# Altium schematic sheet AD_DA.SchDoc
size A4; SheetNumber: 1; SheetTotal: 6
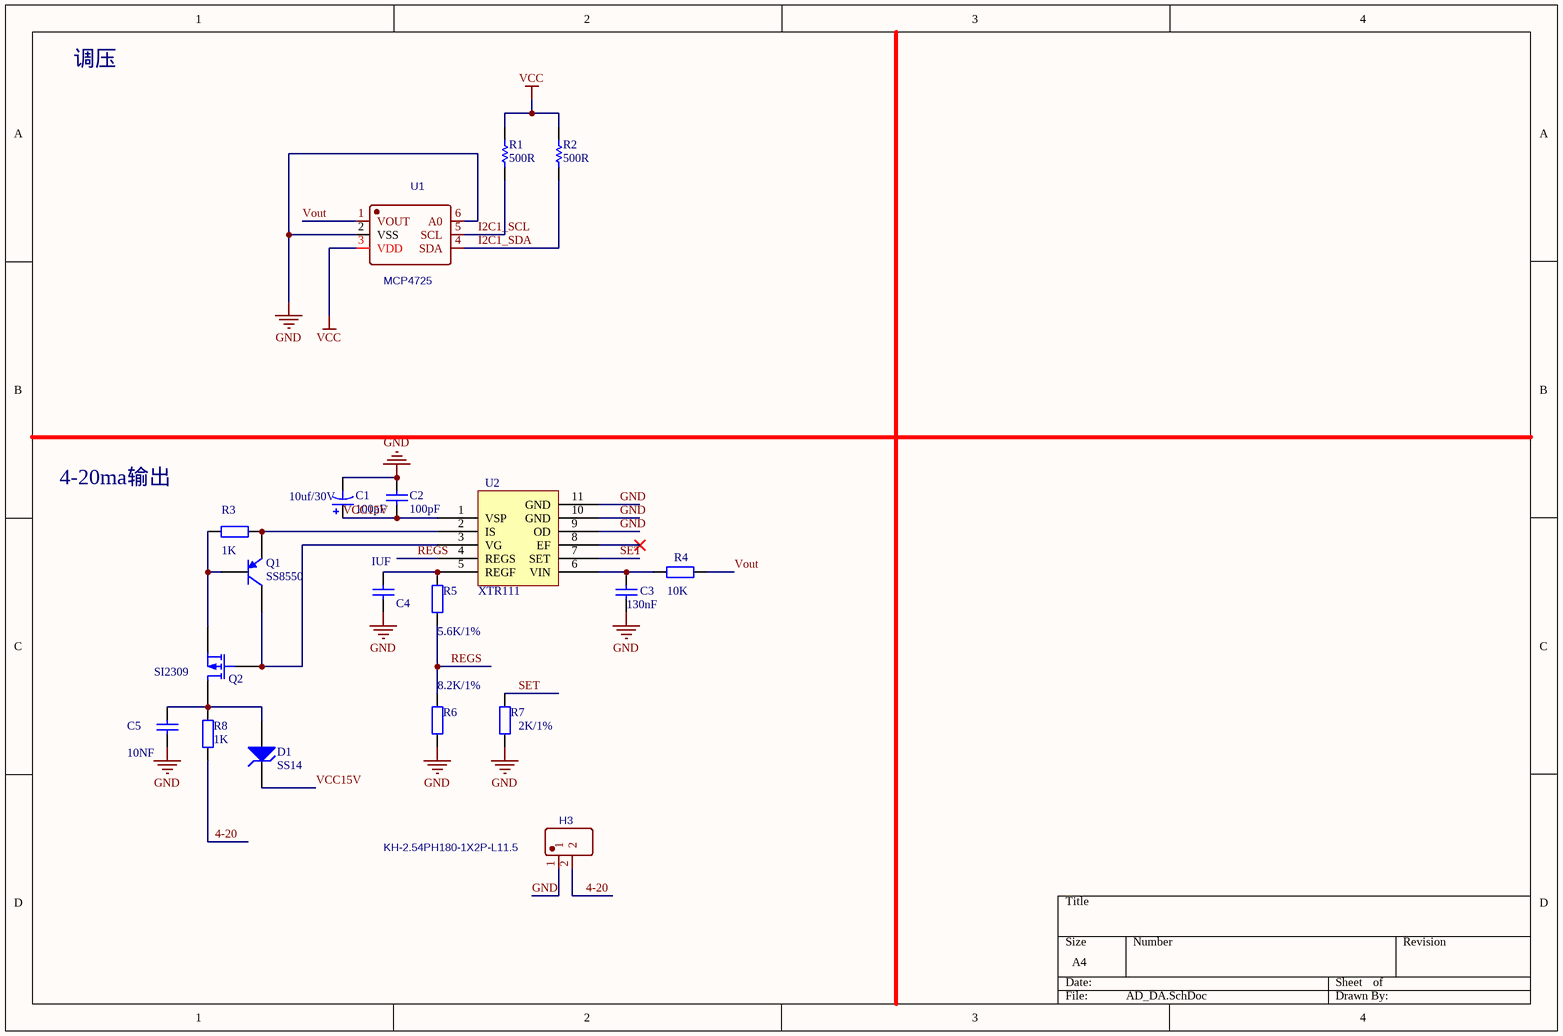
[diagram p0: AD_DA.SchDoc]

## Parts
C1  10uf/30V  value 100pF  [RB7.6-15]
C2  value 100pF  [RAD-0.3]  (hidden comment: 104)
C3  130nF  [0603]
C4  IUF  [RAD-0.3]
C5  10NF  [RAD-0.3]
D1  SS14  [DIODE-0.7]
H3  KH-2.54PH180-1X2P-L11.5  [1*2P]
Q1  SS8550  [SOT-23B_N]
Q2  SI2309  [E3]
R1  500R  [0805R]
R2  500R  [0805R]
R3  value 1K  [0603_R]  (hidden comment: 15R)
R4  10K  [0603_R]
R5  5.6K/1%  [0603_R]
R6  8.2K/1%  [0603_R]
R7  2K/1%  [0603_R]
R8  value 1K  [0603_R]  (hidden comment: 15R)
U1  MCP4725  [MCP4725]
U2  XTR111  [XTR111]

## Nets
GND: C1.2 C2.1 C3.2 C4.1 C5.2 H3.1 R6.2 R7.1 U1.2(VSS) U1.6(A0) U2.9(OD) U2.10(GND) U2.11(GND)
VCC: R1.2 R2.2 U1.3(VDD)
4-20: H3.2 R8.2
I2C1_SCL: R1.1 U1.5(SCL)
I2C1_SDA: R2.1 U1.4(SDA)
REGS: R5.2 R6.1 U2.4(REGS)
SET: R7.2 U2.7(SET)
VCC15V: C1.1 C2.2 D1.2(K) U2.1(VSP)
Vout: R4.2 U1.1(VOUT)
NetC3_1: C3.1 R4.1 U2.6(VIN)
NetC4_2: C4.2 R5.1 U2.5(REGF)
NetC5_1: C5.1 D1.1(A) Q2.1(D) R8.1
NetQ1_1: Q1.1(C) Q2.2(G) U2.3(VG)
NetQ1_2: Q1.2(B) Q2.3(S) R3.2
NetQ1_3: Q1.3(E) R3.1 U2.2(IS)

Not connected (* = marked no-connect by the designer): U2 8(EF)*

## Notes on the sheet
- 调压
- 4-20ma输出

## Library data of the parts
C1 = Cap Pol1: Polarized Capacitor (Radial); Published: 8-Jun-2000; LatestRevisionDate: 17-Jul-2002; LatestRevisionNote: Re-released for DXP Platform.; PackageReference: RB7.6-15; Publisher: Altium Limited; PackageDescription: Polarized Capacitor (Radial); 2 Leads
C2 = Cap: Capacitor; Published: 8-Jun-2000; LatestRevisionDate: 17-Jul-2002; LatestRevisionNote: Re-released for DXP Platform.; PackageReference: RAD-0.3; Publisher: Altium Limited; PackageDescription: Radial Cap, Thru-Hole; 2 Leads; 0.3 in Pin Spacing
C3 = Cap Smd: Capacitor
C4 C5 = Cap: Capacitor; Value: 100pF; Published: 8-Jun-2000; LatestRevisionDate: 17-Jul-2002; LatestRevisionNote: Re-released for DXP Platform.; PackageReference: RAD-0.3; Publisher: Altium Limited; PackageDescription: Radial Cap, Thru-Hole; 2 Leads; 0.3 in Pin Spacing
D1 = D Zener: Zener Diode; Published: 8-Jun-2000; Publisher: Altium Limited; LatestRevisionDate: 17-Jul-2002; LatestRevisionNote: Re-released for DXP Platform.; PackageReference: DIODE-0.7; PackageDescription: Diode, Thru-Hole; 2 Leads; 0.7 in Pin Spacing
H3 = KH-2.54PH180-1X2P-L11.5: BOM_Manufacturer: kinghelm(金航标); BOM_Manufacturer Part: KH-2.54PH180-1X4P-L11.5; Contributor: LCSC; BOM_Supplier: LCSC; BOM_Supplier Part: C2905435; spicePre: H; spiceSymbolName: KH-2.54PH180-1X4P-L11.5
Q1 = PNP: PNP Bipolar Transistor; Published: 8-Jun-2000; LatestRevisionDate: 29-May-2009; LatestRevisionNote: IPC-7351 Footprint Added.; PackageVersion: Aug-1999; PackageReference: SOT-23B; Publisher: Altium Limited; PackageDescription: 3-Pin SOT-23 Package 0.95 mm Pitch, 2.4 mm Lead Span
Q2 = MOSFET-P: P-Channel MOSFET; Published: 8-Jun-2000; LatestRevisionDate: 17-Jul-2002; LatestRevisionNote: Re-released for DXP Platform.; PackageVersion: 1995/1996; PackageReference: E3; Publisher: Altium Limited; PackageDescription: TO, Flat Index; 3 In-Line, Axial Leads; Body Dia. 4.6mm; Lead Dia. 0.5 mm (max)
R1 R2 = RES: Resistor; Value: 1K; Published: 8-Jun-2000; Revision: July-2002: Re-released for DXP Platform.; Publisher: Altium Limited
R3 R8 = Res2: Resistor; Published: 8-Jun-2000; LatestRevisionDate: 17-Jul-2002; LatestRevisionNote: Re-released for DXP Platform.; PackageReference: AXIAL-0.4; Publisher: Altium Limited; PackageDescription: Axial Device, Thru-Hole; 2 Leads; 0.4 in Pin Spacing
R4-R7 = Res2: Resistor; Value: 1K; Published: 8-Jun-2000; LatestRevisionDate: 17-Jul-2002; LatestRevisionNote: Re-released for DXP Platform.; PackageReference: AXIAL-0.4; Publisher: Altium Limited; PackageDescription: Axial Device, Thru-Hole; 2 Leads; 0.4 in Pin Spacing
U1 = MCP4725A0T-E/CH: BOM_Manufacturer: MICROCHIP; Contributor: LCSC; BOM_Supplier: LCSC; BOM_Manufacturer Part: MCP4725A0T-E/CH; BOM_Supplier Part: C144198; BOM_JLCPCB Part Class: Extended Part; spicePre: U; spiceSymbolName: MCP4725A0T-E/CH